# EAGLE schematic PD_Filter_Amp (EAGLE 9.7.0)
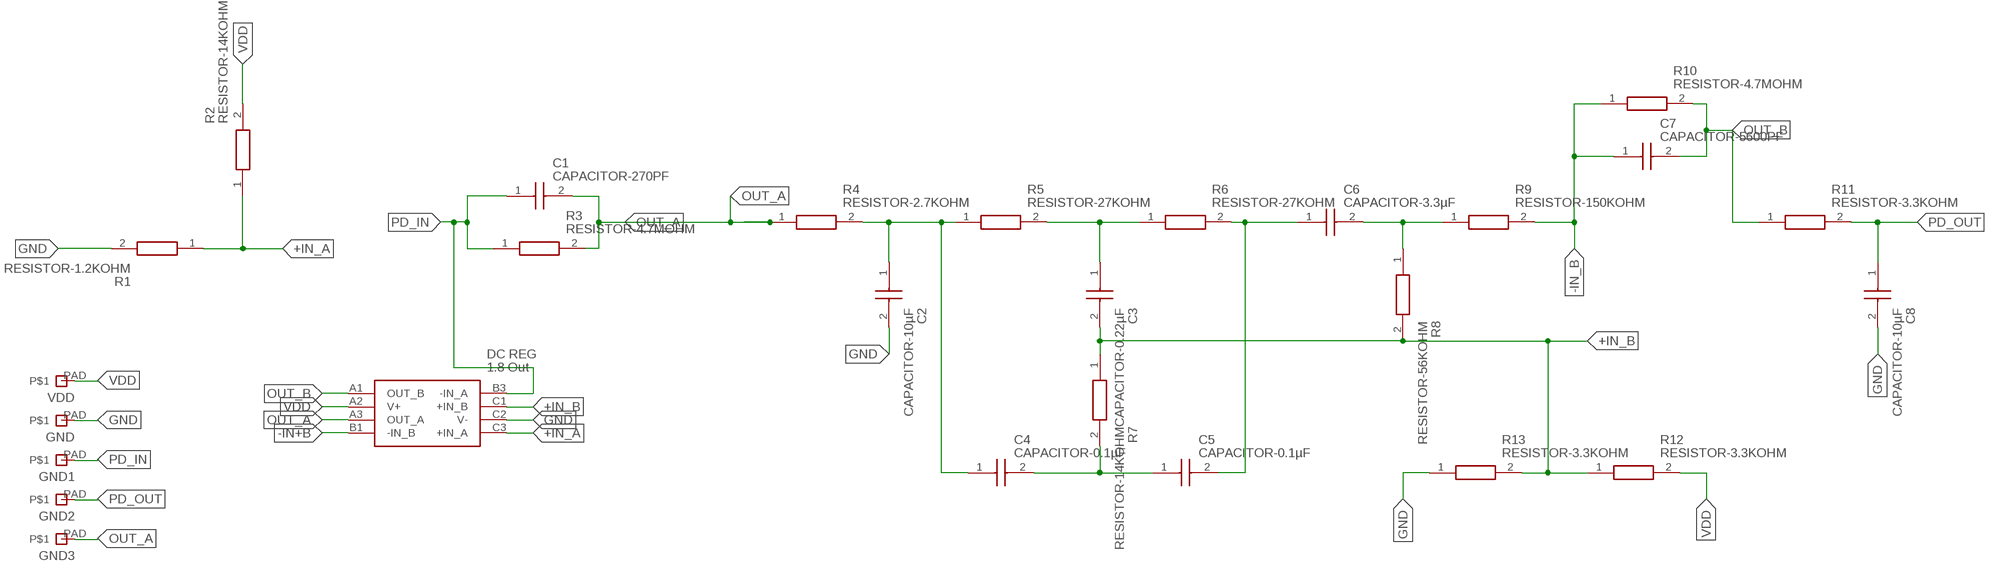
[diagram p0: schematic, sheet 1]

## Parts
C1  CAPACITOR-270PF  [CAPC1005X55N]
C2  CAPACITOR-10µF  [C0402]
C3  CAPACITOR-0.22µF  [CAPC1005X55N]
C4  CAPACITOR-0.1µF  [CAPC1005X55N]
C5  CAPACITOR-0.1µF  [CAPC1005X55N]
C6  CAPACITOR-3.3µF  [C0402]
C7  CAPACITOR-5600PF  [CAPC1005X55N]
C8  CAPACITOR-10µF  [C0402]
GND  PAD  [PAD]
GND1  PAD  [PAD]
GND2  PAD  [PAD]
GND3  PAD  [PAD]
IC1  ADA4505-2  [BGA8C50P3X3_142X142X65]
R1  RESISTOR-1.2KOHM  [ERJPA2_(0402)]
R2  RESISTOR-14KOHM  [ERJ2RKD1004X]
R3  RESISTOR-4.7MOHM  [ERJ2RKD1004X]
R4  RESISTOR-2.7KOHM  [ERJPA2_(0402)]
R5  RESISTOR-27KOHM  [ERJ2RKD1004X]
R6  RESISTOR-27KOHM  [ERJ2RKD1004X]
R7  RESISTOR-14KOHM  [ERJ2RKD1004X]
R8  RESISTOR-56KOHM  [ERJ2RKD1004X]
R9  RESISTOR-150KOHM  [ERJS02_U02_(0402)]
R10  RESISTOR-4.7MOHM  [ERJ2RKD1004X]
R11  RESISTOR-3.3KOHM  [ERJPA2_(0402)]
R12  RESISTOR-3.3KOHM  [ERJPA2_(0402)]
R13  RESISTOR-3.3KOHM  [ERJPA2_(0402)]
VDD  PAD  [PAD]

## Nets
+IN_A: IC1.C3(+IN_A) R1.1 R2.1
+IN_B: C3.2 IC1.C1(+IN_B) R7.1 R8.2 R12.1 R13.2
-IN+B: IC1.B1(-IN_B)
-IN_B: C7.1 R9.2 R10.1
GND: C2.2 C8.2 GND.PAD IC1.C2(V-) R1.2 R13.1
N$1: C2.1 C4.1 R4.2 R5.1
N$2: C3.1 R5.2 R6.1
N$6: C4.2 C5.1 R7.2
N$7: C5.2 C6.1 R6.2
N$8: C6.2 R8.1 R9.1
OUT_A: C1.2 GND3.PAD IC1.A3(OUT_A) R3.2 R4.1
OUT_B: C7.2 IC1.A1(OUT_B) R10.2 R11.1
PD_IN: C1.1 GND1.PAD IC1.B3(-IN_A) R3.1
PD_OUT: C8.1 GND2.PAD R11.2
VDD: IC1.A2(V+) R2.2 R12.2 VDD.PAD

## Library data of the parts
C1 = MABOS_Library:CAPACITOR-270PF: SMD Comm C0G, Ceramic, 270 pF, 2%, 50 VDC, 125 VDC, 125C, -55C, C0G, SMD, MLCC, Ultra-Stable, Low Loss, Class I, 0.1 % , 100 GOhms, 1.06 mg, 0402, 1mm, 0.5mm, 0.5mm, 0.3mm, 0.3mm, 10000, 78 Weeks, 120 Source: Datasheet <https://componentsearchengine.com/Datasheets/1/C0402C271G5GACTU.pdf>; DESCRIPTION: SMD Comm C0G, Ceramic, 270 pF, 2%, 50 VDC, 125 VDC, 125C, -55C, C0G, SMD, MLCC, Ultra-Stable, Low Loss, Class I, 0.1 % , 100 GOhms, 1.06 mg, 0402, 1mm, 0.5mm, 0.5mm, 0.3mm, 0.3mm, 10000, 78 Weeks, 120; HEIGHT: 0.55mm; MANUFACTURER_NAME: KEMET; MANUFACTURER_PART_NUMBER: C0402C271G5GACTU; MOUSER_PART_NUMBER: 80-C0402C271G5G; MOUSER_PRICE-STOCK: https://www.mouser.com/Search/Refine.aspx?Keyword=80-C0402C271G5G
C2 C8 = MABOS_Library:CAPACITOR-10µF: SMD Comm X5R, Ceramic, 10 uF, 20%, 6.3 VDC, 15.75 VDC, 85C, -55C, X5R, SMD, MLCC, Temperature Stable, Class II, 10 % , 10 MOhms, 1.41 mg, 0402, 1mm, 0.5mm, 0.5mm, 0.3mm, 0.3mm, 10000, 78 Weeks, 70 Source: Datasheet <https://content.kemet.com/datasheets/KEM_C1006_X5R_SMD.pdf>; DESCRIPTION: SMD Comm X5R, Ceramic, 10 uF, 20%, 6.3 VDC, 15.75 VDC, 85C, -55C, X5R, SMD, MLCC, Temperature Stable, Class II, 10 % , 10 MOhms, 1.41 mg, 0402, 1mm, 0.5mm, 0.5mm, 0.3mm, 0.3mm, 10000, 78 Weeks, 70; HEIGHT: 0.55mm; MANUFACTURER_NAME: KEMET; MANUFACTURER_PART_NUMBER: C0402C106M9PACTU; MOUSER_PART_NUMBER: 80-C0402C106M9P; MOUSER_PRICE-STOCK: https://www.mouser.co.uk/ProductDetail/KEMET/C0402C106M9PACTU?qs=x4XeXhDQKnp%252Bz0lMlwMC3A%3D%3D
C3 = MABOS_Library:CAPACITOR-0.22µF: SMD Comm X5R, Ceramic, 0.22 uF, 10%, 6.3 VDC, 15.75 VDC, 85C, -55C, X5R, SMD, MLCC, Temperature Stable, Class II, 10 % , 2.2727 GOhms, 1.21 mg, 0402, 1mm, 0.5mm, 0.5mm, 0.3mm, 0.3mm, 10000, 78 Weeks, 70 Source: Datasheet <https://content.kemet.com/datasheets/KEM_C1002_X7R_SMD.pdf>; DESCRIPTION: SMD Comm X5R, Ceramic, 0.22 uF, 10%, 6.3 VDC, 15.75 VDC, 85C, -55C, X5R, SMD, MLCC, Temperature Stable, Class II, 10 % , 2.2727 GOhms, 1.21 mg, 0402, 1mm, 0.5mm, 0.5mm, 0.3mm, 0.3mm, 10000, 78 Weeks, 70; HEIGHT: 0.55mm; MANUFACTURER_NAME: KEMET; MANUFACTURER_PART_NUMBER: C0402C224K9PACTU; MOUSER_PART_NUMBER: 80-C0402C224K9P; MOUSER_PRICE-STOCK: https://www.mouser.co.uk/ProductDetail/KEMET/C0402C224K9PACTU?qs=RCLU9o6%252BptzyXOocONqIew%3D%3D
C4 C5 = MABOS_Library:CAPACITOR-0.1µF: SMD Comm X7R, Ceramic, 0.1 uF, 20%, 16 VDC, 40 VDC, 125C, -55C, X7R, SMD, MLCC, Temperature Stable, Class II, 10 % , 5 GOhms, 1.21 mg, 0402, 1mm, 0.5mm, 0.5mm, 0.3mm, 0.3mm, 10000, 78 Weeks, 80 Source: Datasheet <https://content.kemet.com/datasheets/KEM_C1002_X7R_SMD.pdf>; DESCRIPTION: SMD Comm X7R, Ceramic, 0.1 uF, 20%, 16 VDC, 40 VDC, 125C, -55C, X7R, SMD, MLCC, Temperature Stable, Class II, 10 % , 5 GOhms, 1.21 mg, 0402, 1mm, 0.5mm, 0.5mm, 0.3mm, 0.3mm, 10000, 78 Weeks, 80; HEIGHT: 0.55mm; MANUFACTURER_NAME: KEMET; MANUFACTURER_PART_NUMBER: C0402C104M4RACTU; MOUSER_PART_NUMBER: 80-C0402C104M4R; MOUSER_PRICE-STOCK: https://www.mouser.co.uk/ProductDetail/KEMET/C0402C104M4RACTU?qs=JZ1tlzCDhS7cY%252B6lsIooCQ%3D%3D
C6 = MABOS_Library:CAPACITOR-3.3µF: SMD Comm X5R, Ceramic, 3.3 uF, 20%, 4 VDC, 10 VDC, 85C, -55C, X5R, SMD, MLCC, Temperature Stable, Class II, 10 % , 30.3 MOhms, 1.21 mg, 0402, 1mm, 0.5mm, 0.5mm, 0.3mm, 0.3mm, 10000, 78 Weeks, 70 Source: Datasheet <https://content.kemet.com/datasheets/KEM_C1006_X5R_SMD.pdf>; DESCRIPTION: SMD Comm X5R, Ceramic, 3.3 uF, 20%, 4 VDC, 10 VDC, 85C, -55C, X5R, SMD, MLCC, Temperature Stable, Class II, 10 % , 30.3 MOhms, 1.21 mg, 0402, 1mm, 0.5mm, 0.5mm, 0.3mm, 0.3mm, 10000, 78 Weeks, 70; HEIGHT: 0.55mm; MANUFACTURER_NAME: KEMET; MANUFACTURER_PART_NUMBER: C0402C335M7PACTU; MOUSER_PART_NUMBER: 80-C0402C335M7P; MOUSER_PRICE-STOCK: https://www.mouser.co.uk/ProductDetail/KEMET/C0402C335M7PACTU?qs=K%2Fj%2Fqf%252B0fqJuKSSbbJXSEQ%3D%3D
C7 = MABOS_Library:CAPACITOR-5600PF: SMD Comm X7R, Ceramic, 5600 pF, 5%, 16 VDC, 40 VDC, 125C, -55C, X7R, SMD, MLCC, Temperature Stable, Class II, 3.5 % , 100 GOhms, 1.21 mg, 0402, 1mm, 0.5mm, 0.5mm, 0.3mm, 0.3mm, 10000, 78 Weeks, 80 Source: Datasheet <https://content.kemet.com/datasheets/KEM_C1002_X7R_SMD.pdf>; DESCRIPTION: SMD Comm X7R, Ceramic, 5600 pF, 5%, 16 VDC, 40 VDC, 125C, -55C, X7R, SMD, MLCC, Temperature Stable, Class II, 3.5 % , 100 GOhms, 1.21 mg, 0402, 1mm, 0.5mm, 0.5mm, 0.3mm, 0.3mm, 10000, 78 Weeks, 80; HEIGHT: 0.55mm; MANUFACTURER_NAME: KEMET; MANUFACTURER_PART_NUMBER: C0402C562J4RACTU; MOUSER_PART_NUMBER: 80-C0402C562J4R; MOUSER_PRICE-STOCK: https://www.mouser.co.uk/ProductDetail/KEMET/C0402C562J4RACTU?qs=YJD0VjdmSUns5e35Blws8w%3D%3D
GND GND1-GND3 VDD = Nordic_BLE:PAD
IC1 = MABOS_Library:ADA4505-2: Op Amp (2); DESCRIPTION: ANALOG DEVICES - ADA4505-2ACBZ-R7 - OP-AMP, DUAL, 50KHZ, WLCSP-8; HEIGHT: 0.65mm; MANUFACTURER_NAME: Analog Devices; MANUFACTURER_PART_NUMBER: ADA4505-2ACBZ-R7; MOUSER_PART_NUMBER: 584-ADA4505-2ACBZ-R7; MOUSER_PRICE-STOCK: https://www.mouser.co.uk/ProductDetail/Analog-Devices/ADA4505-2ACBZ-R7?qs=BpaRKvA4VqEsLtXU3NSLDQ%3D%3D
R1 = MABOS_Library:RESISTOR-1.2KOHM: Anti-Surge Thick Film Chip Resistor, 0402, 0.2W Source: Datasheet <https://componentsearchengine.com/Datasheets/1/ERJ-PA2D1201X.pdf>; DESCRIPTION: Anti-Surge Thick Film Chip Resistor, 0402, 0.2W; HEIGHT: 0.4mm; MANUFACTURER_NAME: Panasonic; MANUFACTURER_PART_NUMBER: ERJ-PA2D1201X; MOUSER_PART_NUMBER: 667-ERJ-PA2D1201X; MOUSER_PRICE-STOCK: https://www.mouser.com/Search/Refine.aspx?Keyword=667-ERJ-PA2D1201X
R2 R7 = MABOS_Library:RESISTOR-14KOHM: Panasonic ERJ2RK Series Thick Film Resistor 14k +/-1% 0.1W +/-100ppm/C Source: Datasheet <https://componentsearchengine.com/Datasheets/1/ERJ-2RKF1402X.pdf>; DESCRIPTION: Panasonic ERJ2RK Series Thick Film Resistor 14k +/-1% 0.1W +/-100ppm/C; HEIGHT: 0.4mm; MANUFACTURER_NAME: Panasonic; MANUFACTURER_PART_NUMBER: ERJ-2RKF1402X; MOUSER_PART_NUMBER: 667-ERJ-2RKF1402X; MOUSER_PRICE-STOCK: https://www.mouser.com/Search/ProductDetail.aspx?qs=MVjVSMjNRMrMgFTFLdW36A%3d%3d
R3 R10 = MABOS_Library:RESISTOR-4.7MOHM: Panasonic ERJ2GEJ Series Thick Film Surface Mount Fixed Resistor 0402 Case 4.7M +/-5% 0.1W -400 +150ppm/C Source: Datasheet <https://componentsearchengine.com/Datasheets/1/ERJ-2GEJ475X.pdf>; DESCRIPTION: Panasonic ERJ2GEJ Series Thick Film Surface Mount Fixed Resistor 0402 Case 4.7M +/-5% 0.1W -400 +150ppm/C; HEIGHT: 0.4mm; MANUFACTURER_NAME: Panasonic; MANUFACTURER_PART_NUMBER: ERJ-2GEJ475X; MOUSER_PART_NUMBER: 667-ERJ-2GEJ475X; MOUSER_PRICE-STOCK: https://www.mouser.com/Search/Refine.aspx?Keyword=667-ERJ-2GEJ475X
R4 = MABOS_Library:RESISTOR-2.7KOHM: Anti-Surge Thick Film Chip Resistor, 0402, 0.2W Source: Datasheet <http://industrial.panasonic.com/cdbs/www-data/pdf/RDO0000/AOA0000C331.pdf>; DESCRIPTION: Anti-Surge Thick Film Chip Resistor, 0402, 0.2W; HEIGHT: 0.4mm; MANUFACTURER_NAME: Panasonic; MANUFACTURER_PART_NUMBER: ERJ-PA2F2701X
R5 R6 = MABOS_Library:RESISTOR-27KOHM: Panasonic Precision Thick Film Surface Mount Resistor 0402 Case 27k +/-0.5% 0.063W +/-50ppm/C Source: Datasheet <https://componentsearchengine.com/Datasheets/1/ERJ-2RHD2702X.pdf>; DESCRIPTION: Panasonic Precision Thick Film Surface Mount Resistor 0402 Case 27k +/-0.5% 0.063W +/-50ppm/C; HEIGHT: 0.4mm; MANUFACTURER_NAME: Panasonic; MANUFACTURER_PART_NUMBER: ERJ-2RHD2702X; MOUSER_PART_NUMBER: 667-ERJ-2RHD2702X; MOUSER_PRICE-STOCK: https://www.mouser.com/Search/Refine.aspx?Keyword=667-ERJ-2RHD2702X
R8 = MABOS_Library:RESISTOR-56KOHM: Precision Thick Film Chip Resistor, 0402, 0.063W Source: Datasheet <https://componentsearchengine.com/Datasheets/1/ERJ-2RKF5602X.pdf>; DESCRIPTION: Precision Thick Film Chip Resistor, 0402, 0.063W; HEIGHT: 0.4mm; MANUFACTURER_NAME: Panasonic; MANUFACTURER_PART_NUMBER: ERJ-2RKF5602X; MOUSER_PART_NUMBER: 667-ERJ-2RKF5602X; MOUSER_PRICE-STOCK: https://www.mouser.com/Search/Refine.aspx?Keyword=667-ERJ-2RKF5602X
R9 = MABOS_Library:RESISTOR-150KOHM: Anti-Sulfurated Thick Film Chip Resistor, 0402, 0.1W Source: Datasheet <https://componentsearchengine.com/Datasheets/1/ERJ-U02D1503X.pdf>; DESCRIPTION: Anti-Sulfurated Thick Film Chip Resistor, 0402, 0.1W; HEIGHT: 0.4mm; MANUFACTURER_NAME: Panasonic; MANUFACTURER_PART_NUMBER: ERJ-U02D1503X; MOUSER_PART_NUMBER: 667-ERJ-U02D1503X; MOUSER_PRICE-STOCK: https://www.mouser.com/Search/Refine.aspx?Keyword=667-ERJ-U02D1503X
R11-R13 = MABOS_Library:RESISTOR-3.3KOHM: Anti-Surge Thick Film Chip Resistor, 0402, 0.2W Source: Datasheet <https://componentsearchengine.com/Datasheets/1/ERJ-PA2F3301X.pdf>; DESCRIPTION: Anti-Surge Thick Film Chip Resistor, 0402, 0.2W; HEIGHT: 0.4mm; MANUFACTURER_NAME: Panasonic; MANUFACTURER_PART_NUMBER: ERJ-PA2F3301X; MOUSER_PART_NUMBER: 667-ERJ-PA2F3301X; MOUSER_PRICE-STOCK: https://www.mouser.com/Search/Refine.aspx?Keyword=667-ERJ-PA2F3301X